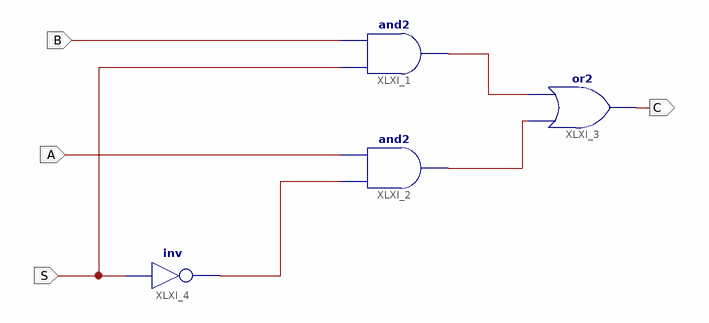
[diagram p0: schematic sheet 1]
// Xilinx ISE schematic MUX2T1.sch (kintex7) as structural Verilog: 4 symbols, 4 ports
module MUX2T1 (
  input  A,
  input  B,
  input  S,
  output C
);

  wire XLXN_2, XLXN_6, XLXN_7;

  and XLXI_1 (XLXN_6, S, B);
  and XLXI_2 (XLXN_7, XLXN_2, A);
  or XLXI_3 (C, XLXN_7, XLXN_6);
  not XLXI_4 (XLXN_2, S);
endmodule
